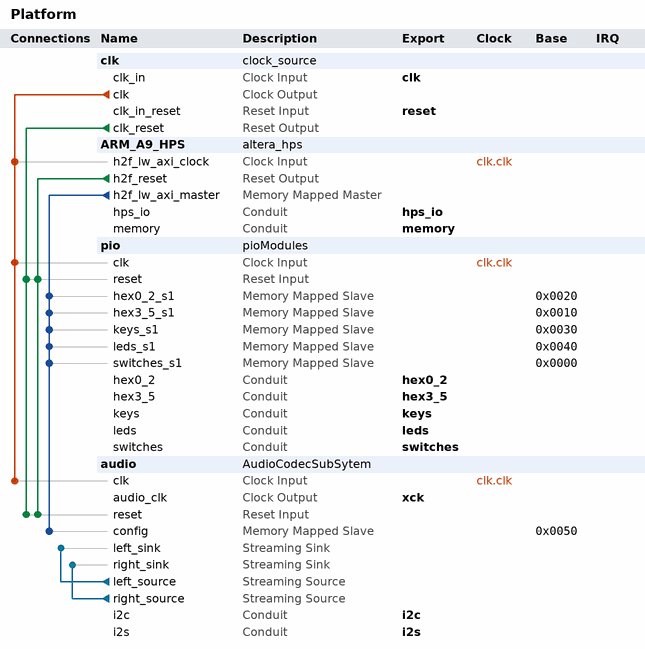
[diagram p0: system contents]
# Platform Designer (Qsys) system Platform, Cyclone V 5CSEMA5F31C6
# Parameters at their usual value, and those the tool derives, are not listed.
package require -exact qsys 16.1
create_system Platform
set_project_property DEVICE_FAMILY {Cyclone V}
set_project_property DEVICE 5CSEMA5F31C6

add_instance clk clock_source 16.1
set_instance_parameter_value clk clockFrequency 50000000

add_instance ARM_A9_HPS altera_hps 16.1
set_instance_parameter_value ARM_A9_HPS EMAC1_Mode N/A
set_instance_parameter_value ARM_A9_HPS EMAC1_PinMuxing Unused
set_instance_parameter_value ARM_A9_HPS F2SCLK_COLDRST_Enable false
set_instance_parameter_value ARM_A9_HPS F2SCLK_DBGRST_Enable false
set_instance_parameter_value ARM_A9_HPS F2SCLK_WARMRST_Enable false
set_instance_parameter_value ARM_A9_HPS F2SINTERRUPT_Enable false
set_instance_parameter_value ARM_A9_HPS F2S_Width 0
set_instance_parameter_value ARM_A9_HPS FPGA_PERIPHERAL_OUTPUT_CLOCK_FREQ_EMAC0_GTX_CLK 125
set_instance_parameter_value ARM_A9_HPS FPGA_PERIPHERAL_OUTPUT_CLOCK_FREQ_EMAC0_MD_CLK 2.5
set_instance_parameter_value ARM_A9_HPS FPGA_PERIPHERAL_OUTPUT_CLOCK_FREQ_EMAC1_GTX_CLK 125
set_instance_parameter_value ARM_A9_HPS FPGA_PERIPHERAL_OUTPUT_CLOCK_FREQ_EMAC1_MD_CLK 2.5
set_instance_parameter_value ARM_A9_HPS HPS_PROTOCOL DDR3
set_instance_parameter_value ARM_A9_HPS I2C0_Mode N/A
set_instance_parameter_value ARM_A9_HPS I2C0_PinMuxing Unused
set_instance_parameter_value ARM_A9_HPS I2C1_Mode N/A
set_instance_parameter_value ARM_A9_HPS I2C1_PinMuxing Unused
set_instance_parameter_value ARM_A9_HPS LWH2F_Enable true
set_instance_parameter_value ARM_A9_HPS MEM_BANKADDR_WIDTH 3
set_instance_parameter_value ARM_A9_HPS MEM_CLK_FREQ 400.0
set_instance_parameter_value ARM_A9_HPS MEM_COL_ADDR_WIDTH 10
set_instance_parameter_value ARM_A9_HPS MEM_DQ_WIDTH 32
set_instance_parameter_value ARM_A9_HPS MEM_DRV_STR RZQ/7
set_instance_parameter_value ARM_A9_HPS MEM_ROW_ADDR_WIDTH 15
set_instance_parameter_value ARM_A9_HPS MEM_RTT_NOM RZQ/4
set_instance_parameter_value ARM_A9_HPS MEM_RTT_WR RZQ/4
set_instance_parameter_value ARM_A9_HPS MEM_TCL 11
set_instance_parameter_value ARM_A9_HPS MEM_TFAW_NS 30.0
set_instance_parameter_value ARM_A9_HPS MEM_TRAS_NS 35.0
set_instance_parameter_value ARM_A9_HPS MEM_TRCD_NS 13.75
set_instance_parameter_value ARM_A9_HPS MEM_TRFC_NS 260.0
set_instance_parameter_value ARM_A9_HPS MEM_TRP_NS 13.75
set_instance_parameter_value ARM_A9_HPS MEM_VENDOR JEDEC
set_instance_parameter_value ARM_A9_HPS MEM_WTCL 8
set_instance_parameter_value ARM_A9_HPS QSPI_Mode N/A
set_instance_parameter_value ARM_A9_HPS QSPI_PinMuxing Unused
set_instance_parameter_value ARM_A9_HPS REF_CLK_FREQ 25.0
set_instance_parameter_value ARM_A9_HPS S2FCLK_USER2CLK 5
set_instance_parameter_value ARM_A9_HPS S2F_Width 0
set_instance_parameter_value ARM_A9_HPS SDIO_Mode N/A
set_instance_parameter_value ARM_A9_HPS SDIO_PinMuxing Unused
set_instance_parameter_value ARM_A9_HPS SPIM1_Mode N/A
set_instance_parameter_value ARM_A9_HPS SPIM1_PinMuxing Unused
set_instance_parameter_value ARM_A9_HPS STM_Enable false
set_instance_parameter_value ARM_A9_HPS TIMING_BOARD_AC_SKEW 0.03
set_instance_parameter_value ARM_A9_HPS TIMING_BOARD_AC_TO_CK_SKEW 0.0
set_instance_parameter_value ARM_A9_HPS TIMING_BOARD_DQ_TO_DQS_SKEW 0.0
set_instance_parameter_value ARM_A9_HPS TIMING_BOARD_MAX_CK_DELAY 0.3
set_instance_parameter_value ARM_A9_HPS TIMING_BOARD_MAX_DQS_DELAY 0.02
set_instance_parameter_value ARM_A9_HPS TIMING_BOARD_SKEW_BETWEEN_DQS 0.08
set_instance_parameter_value ARM_A9_HPS TIMING_BOARD_SKEW_CKDQS_DIMM_MAX 0.16
set_instance_parameter_value ARM_A9_HPS TIMING_BOARD_SKEW_CKDQS_DIMM_MIN 0.09
set_instance_parameter_value ARM_A9_HPS TIMING_BOARD_SKEW_WITHIN_DQS 0.01
set_instance_parameter_value ARM_A9_HPS TIMING_TDH 65
set_instance_parameter_value ARM_A9_HPS TIMING_TDQSCK 255
set_instance_parameter_value ARM_A9_HPS TIMING_TDQSQ 125
set_instance_parameter_value ARM_A9_HPS TIMING_TDS 30
set_instance_parameter_value ARM_A9_HPS TIMING_TIH 140
set_instance_parameter_value ARM_A9_HPS TIMING_TIS 180
set_instance_parameter_value ARM_A9_HPS TIMING_TQSH 0.4
set_instance_parameter_value ARM_A9_HPS UART0_Mode N/A
set_instance_parameter_value ARM_A9_HPS UART0_PinMuxing Unused
set_instance_parameter_value ARM_A9_HPS USB1_Mode N/A
set_instance_parameter_value ARM_A9_HPS USB1_PinMuxing Unused
set_instance_parameter_value ARM_A9_HPS desired_cfg_clk_mhz 97.368421
set_instance_parameter_value ARM_A9_HPS desired_qspi_clk_mhz 400.0

add_instance pio pioModules 1.0

add_instance audio AudioCodecSubSytem 1.0

# connections
add_connection clk.clk ARM_A9_HPS.h2f_lw_axi_clock clock
add_connection clk.clk audio.clk clock
add_connection clk.clk pio.clk clock
add_connection ARM_A9_HPS.h2f_reset audio.reset reset
add_connection ARM_A9_HPS.h2f_reset pio.reset reset
add_connection clk.clk_reset audio.reset reset
add_connection clk.clk_reset pio.reset reset
add_connection ARM_A9_HPS.h2f_lw_axi_master audio.config avalon
set_connection_parameter_value ARM_A9_HPS.h2f_lw_axi_master/audio.config baseAddress 0x0050
add_connection ARM_A9_HPS.h2f_lw_axi_master pio.hex0_2_s1 avalon
set_connection_parameter_value ARM_A9_HPS.h2f_lw_axi_master/pio.hex0_2_s1 baseAddress 0x0020
add_connection ARM_A9_HPS.h2f_lw_axi_master pio.hex3_5_s1 avalon
set_connection_parameter_value ARM_A9_HPS.h2f_lw_axi_master/pio.hex3_5_s1 baseAddress 0x0010
add_connection ARM_A9_HPS.h2f_lw_axi_master pio.keys_s1 avalon
set_connection_parameter_value ARM_A9_HPS.h2f_lw_axi_master/pio.keys_s1 baseAddress 0x0030
add_connection ARM_A9_HPS.h2f_lw_axi_master pio.leds_s1 avalon
set_connection_parameter_value ARM_A9_HPS.h2f_lw_axi_master/pio.leds_s1 baseAddress 0x0040
add_connection ARM_A9_HPS.h2f_lw_axi_master pio.switches_s1 avalon
set_connection_parameter_value ARM_A9_HPS.h2f_lw_axi_master/pio.switches_s1 baseAddress 0x0000
add_connection audio.left_source audio.left_sink avalon_streaming
add_connection audio.right_source audio.right_sink avalon_streaming

# exported interfaces
add_interface clk clock sink
set_interface_property clk EXPORT_OF clk.clk_in
add_interface hex0_2 conduit end
set_interface_property hex0_2 EXPORT_OF pio.hex0_2
add_interface hex3_5 conduit end
set_interface_property hex3_5 EXPORT_OF pio.hex3_5
add_interface hps_io conduit end
set_interface_property hps_io EXPORT_OF ARM_A9_HPS.hps_io
add_interface i2c conduit end
set_interface_property i2c EXPORT_OF audio.i2c
add_interface i2s conduit end
set_interface_property i2s EXPORT_OF audio.i2s
add_interface keys conduit end
set_interface_property keys EXPORT_OF pio.keys
add_interface leds conduit end
set_interface_property leds EXPORT_OF pio.leds
add_interface memory conduit end
set_interface_property memory EXPORT_OF ARM_A9_HPS.memory
add_interface reset reset sink
set_interface_property reset EXPORT_OF clk.clk_in_reset
add_interface switches conduit end
set_interface_property switches EXPORT_OF pio.switches
add_interface xck clock source
set_interface_property xck EXPORT_OF audio.audio_clk

set_interconnect_requirement {$system} qsys_mm.clockCrossingAdapter HANDSHAKE
set_interconnect_requirement {$system} qsys_mm.enableEccProtection FALSE
set_interconnect_requirement {$system} qsys_mm.insertDefaultSlave FALSE
set_interconnect_requirement {$system} qsys_mm.maxAdditionalLatency 1

save_system Platform.qsys
